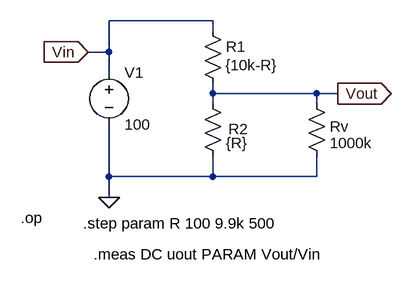
[diagram p0: schematic Belasteter Spannungsteiler_2_sweep_R.asc]
Belasteter Spannungsteiler_2_sweep_R.asc, the LTspice schematic file:
Version 4
SHEET 1 944 680
WIRE 192 48 32 48
WIRE 192 64 192 48
WIRE 32 96 32 48
WIRE 32 96 0 96
WIRE 32 128 32 96
WIRE 192 160 192 144
WIRE 352 160 192 160
WIRE 384 160 352 160
WIRE 192 176 192 160
WIRE 352 176 352 160
WIRE 32 288 32 208
WIRE 192 288 192 256
WIRE 192 288 32 288
WIRE 352 288 352 256
WIRE 352 288 192 288
WIRE 32 320 32 288
FLAG 32 320 0
FLAG 0 96 Vin
IOPIN 0 96 In
FLAG 384 160 Vout
IOPIN 384 160 Out
SYMBOL voltage 32 112 R0
WINDOW 123 0 0 Left 0
WINDOW 39 0 0 Left 0
SYMATTR InstName V1
SYMATTR Value 100
SYMBOL res 176 48 R0
WINDOW 3 35 68 Left 2
SYMATTR Value {10k-R}
SYMATTR InstName R1
SYMBOL res 176 160 R0
WINDOW 0 40 55 Left 2
SYMATTR InstName R2
SYMATTR Value {R}
SYMBOL res 336 160 R0
WINDOW 0 36 51 Left 2
SYMATTR InstName Rv
SYMATTR Value 1000k
TEXT -8 360 Left 2 !.step param R 100 9.9k 500
TEXT -104 352 Left 2 !.op
TEXT 8 408 Left 2 !.meas DC uout PARAM Vout/Vin

The netlist it stands for:
* Belasteter Spannungsteiler_2_sweep_R.asc
V1 Vin 0 100
R1 Vin Vout {10k-R}
R2 Vout 0 {R}
Rv Vout 0 1000k
.step param R 100 9.9k 500
.op
.meas DC uout PARAM Vout/Vin
.backanno
.end